# Altium project PowerSupply.PrjPcb (part 1 of 3)
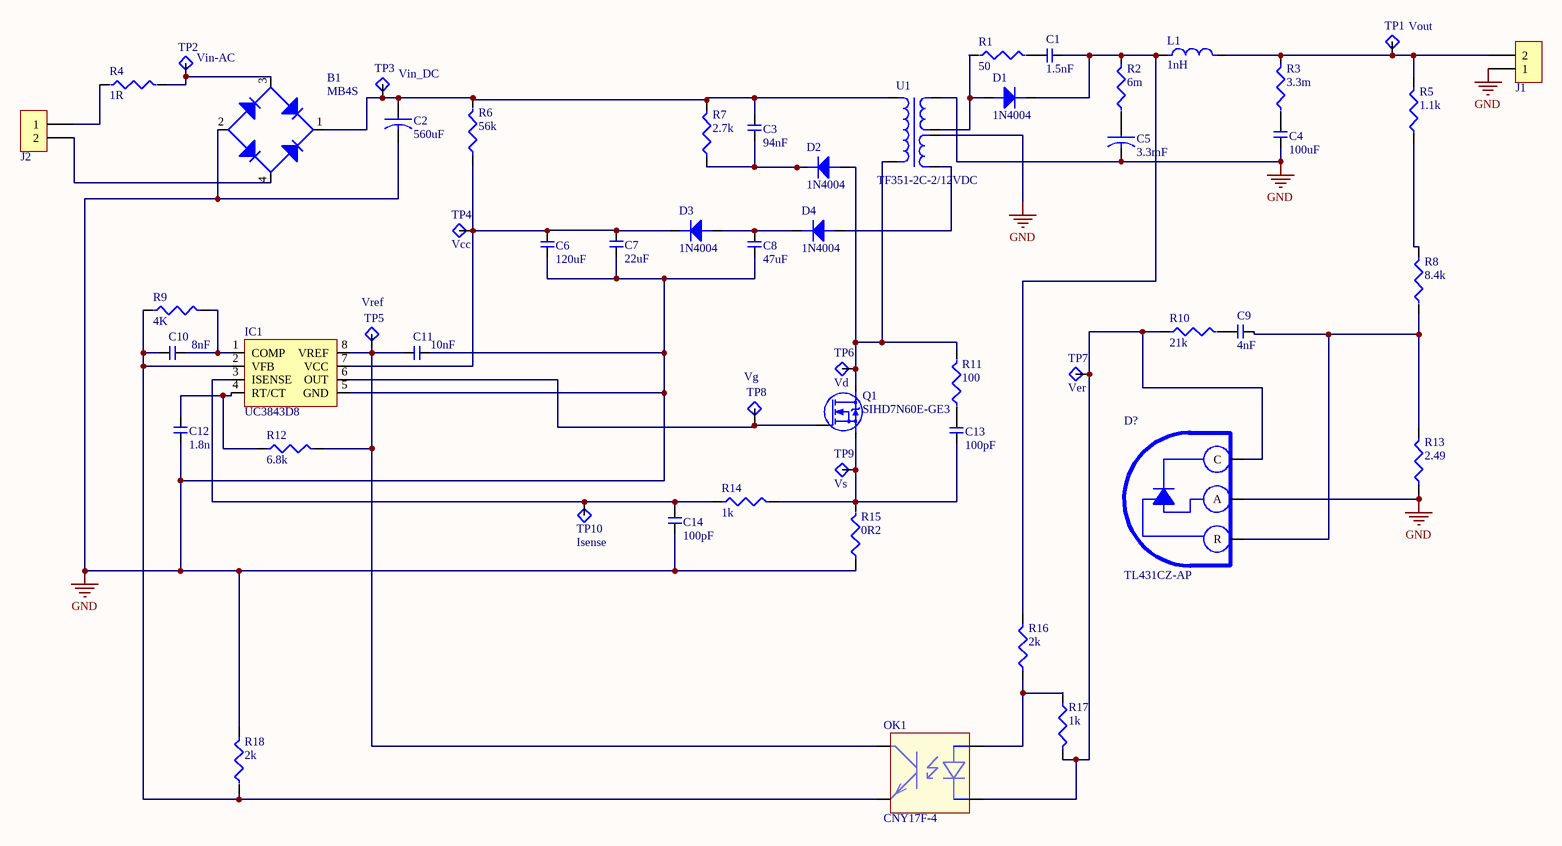
[diagram p0: PowerSupply.SchDoc]
1 sheet, 55 parts. Net scope: global (net labels, ports and power ports of the same name join across sheets).
Board file: PowerSupply.PcbDoc

## Sheet PowerSupply.SchDoc
size A3; SheetNumber: 1; SheetTotal: 1

### Parts
B1  MB4S  [MB4S]
C1  1.5nF  [C0805]
C2  560uF  [EEUFM1C222]
C3  94nF  [C1812]
C4  100uF  [C1210]
C5  3.3mF  [EEU-FC1A332S]
C6  120uF  [C1210]
C7  22uF  [C0805]
C8  47uF  [C0805]
C9  4nF  [C1210]
C10  8nF  [C0805]
C11  10nF  [C0805]
C12  1.8n  [C0603]
C13  100pF  [C0402]
C14  100pF  [C0402]
D1  1N4004  [1N4004]
D2  1N4004  [1N4004]
D3  1N4004  [1N4004]
D4  1N4004  [1N4004]
D?  TL431CZ-AP  [TL431CZ-AP]
IC1  UC3843D8  [UC3843D8]
J1  MC 1,5/ 2-G-3,81 P26 THR  [HEADER-1X2-FCI 77311-118-02LF]  (value not drawn)
J2  MC 1,5/ 2-G-3,81 P26 THR  [HEADER-1X2-FCI 77311-118-02LF]  (value not drawn)
L1  1nH  [L0402]
OK1  CNY17F-4  [CNY17F-4]
Q1  SIHD7N60E-GE3  [SIHD7N60E-GE3]
R1  50  [R0603]
R2  6m  [R0603]
R3  3.3m  [R0603]
R4  1R  [R0402]
R5  1.1k  [R0603]
R6  56k  [R0603]
R7  2.7k  [R0603]
R8  8.4k  [R2010]
R9  4K  [R0603]
R10  21k  [R0603]
R11  100  [R0603]
R12  6.8k  [R0603]
R13  2.49  [R0805]
R14  1k  [R0603]
R15  0R2  [R0402]
R16  2k  [R0603]
R17  1k  [R0603]
R18  2k  [R0603]
TP1  Vout  [TestPoint]
TP2  Vin-AC  [TestPoint]
TP3  Vin_DC  [TestPoint]
TP4  Vcc  [TestPoint]
TP5  Vref  [TestPoint]
TP6  Vd  [TestPoint]
TP7  Ver  [TestPoint]
TP8  Vg  [TestPoint]
TP9  Vs  [TestPoint]
TP10  Isense  [TestPoint]
U1  TF351-2C-2/12VDC  [TF351-2C-2/12VDC]

### Nets
GND: B1.2 C2.N C4.1 C5.N C6.1 C7.1 C8.1 C11.2 C12.1 C14.1 D?.A IC1.5(GND) J1.1 R13.1 R15.1 R18.2 U1.8 U1.12
NetB1_1: B1.1 C2.P C3.2 R6.2 R7.2 TP3.1 U1.1
NetB1_3: B1.3 R4.2 TP2.1
NetB1_4: B1.4 J2.2
NetC1_1: C1.1 R1.2
NetC1_2: C1.2 D1.C L1.1 R2.2 R16.2
NetC3_1: C3.1 D2.C R7.1
NetC4_2: C4.2 R3.1
NetC5_P: C5.P R2.1
NetC6_2: C6.2 C7.2 D3.C IC1.7(VCC) R6.1 TP4.1
NetC8_2: C8.2 D3.A D4.C
NetC9_1: C9.1 R10.2
NetC9_2: C9.2 D?.R R8.1 R13.2
NetC10_1: C10.1 IC1.2(VFB) OK1.E R9.1 R18.1
NetC10_2: C10.2 IC1.1(COMP) R9.2
NetC11_1: C11.1 IC1.8(VREF) OK1.C R12.2 TP5.1
NetC12_2: C12.2 IC1.4(RT/CT) R12.1
NetC13_1: C13.1 Q1.S R14.2 R15.2 TP9.1
NetC13_2: C13.2 R11.1
NetC14_2: C14.2 IC1.3(ISENSE) R14.1 TP10.1
NetD1_A: D1.A R1.1 U1.10
NetD2_A: D2.A Q1.D R11.2 TP6.1 U1.3
NetD4_A: D4.A U1.14
NetD?_C: D?.C OK1.C R10.1 R17.2 TP7.1
NetIC1_6: IC1.6(OUT) Q1.G TP8.1
NetJ1_2: J1.2 L1.2 R3.2 R5.2 TP1.1
NetJ2_1: J2.1 R4.1
NetOK1_A: OK1.A R16.1 R17.1
NetR5_1: R5.1 R8.2